# EAGLE design key (EAGLE 7.2.0)
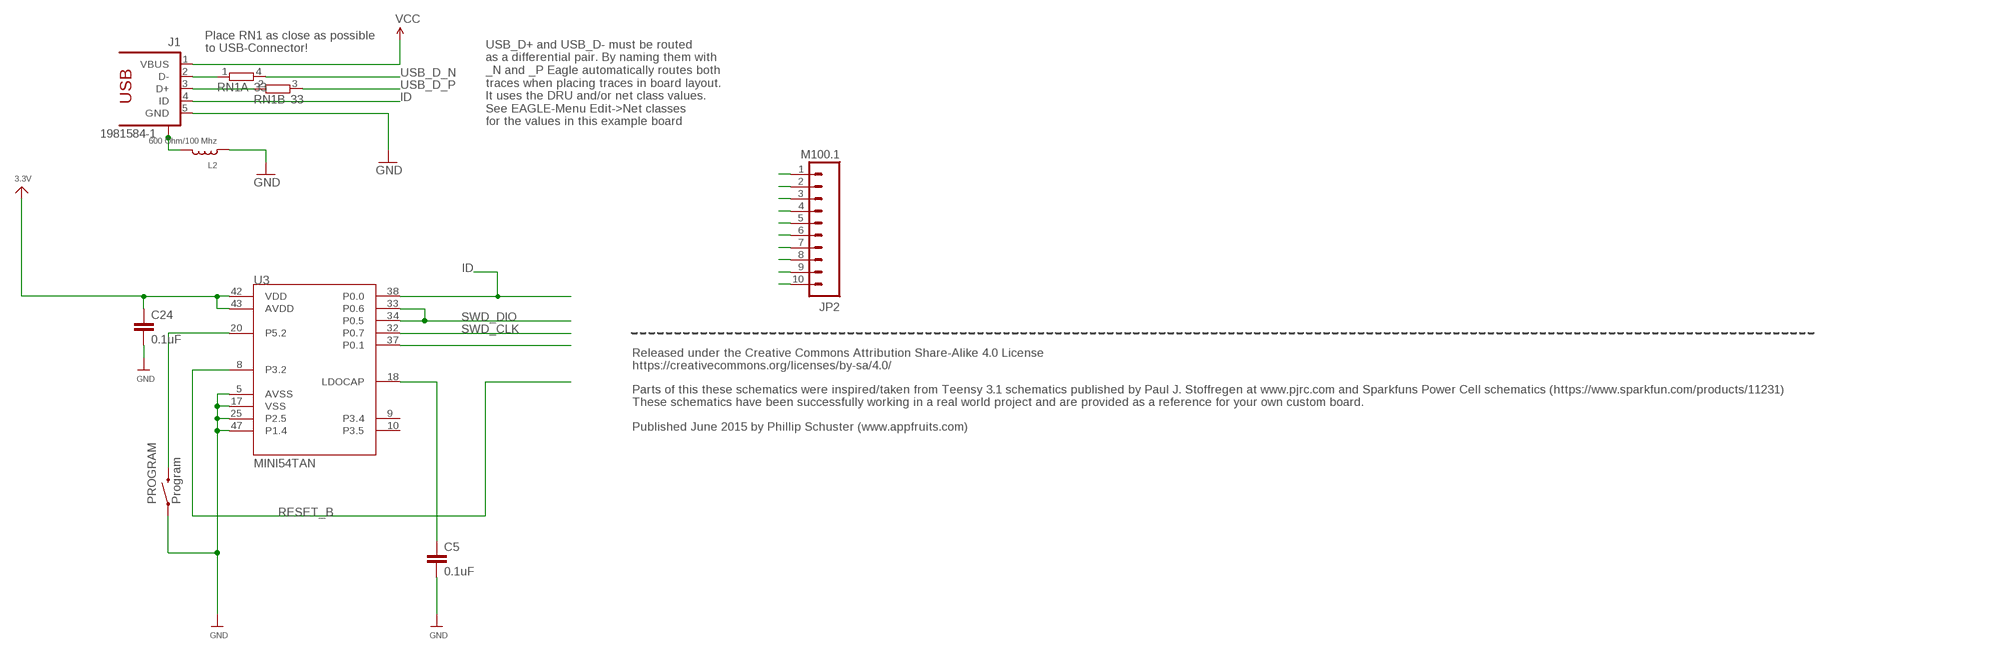
[diagram p0: schematic, sheet 1]

## Parts
C5  0.1uF  CAPACITOR-0.1UF  [0603-CAP]
C24  0.1uF  CAPACITOR-0.1UF  [0603-CAP]
J1  1981584-1  [1981584-1]
JP2  M100.1  [1X10]
L2  600 Ohm/100 Mhz  INDUCTOR-BK2125HM601-T  [0805]
PROGRAM  Program  SWITCH-MOMENTARY-2-SMD-1101NE  [TACTILE-SWITCH-1101NE]
RN1  33  2R-NEXB34V  [EXB34V]
U3  MINI54TAN  [MINI54TAN]

## Nets
3.3V: C24.1 JP2.10 U3.42(VDD) U3.43(AVDD)
GND [Top GND Pour]: C5.2 C24.2 J1.5(GND) JP2.1 L2.1 PROGRAM.P$1 U3.5(AVSS) U3.17(VSS) U3.25(P2.5) U3.47(P1.4)
ID: J1.4(ID) JP2.5 U3.38(P0.0)
N$17: PROGRAM.P$2 U3.20(P5.2)
N$18: C5.1 U3.18(LDOCAP)
P0.1: JP2.8 U3.37(P0.1)
RESET_B: JP2.9 U3.8(P3.2)
SWD_CLK: JP2.7 U3.32(P0.7)
SWD_DIO: JP2.6 U3.33(P0.6) U3.34(P0.5)
USB_CON_N [USB]: J1.2(D-) RN1.1
USB_CON_P [USB]: J1.3(D+) RN1.2
USB_D_N [USB]: JP2.3 RN1.4
USB_D_P [USB]: JP2.4 RN1.3
USB_SHIELD: J1.S1 J1.S2 J1.S3 J1.S4 L2.2
VCC: J1.1(VBUS) JP2.2
Unconnected: U3.9(P3.4) U3.10(P3.5)

## Notes on the sheet
- Place RN1 as close as possible
  to USB-Connector!
- USB_D+ and USB_D- must be routed
  as a differential pair. By naming them with
  _N and _P Eagle automatically routes both
  traces when placing traces in board layout.
  It uses the DRU and/or net class values. 
  See EAGLE-Menu Edit->Net classes 
  for the values in this example board
- Released under the Creative Commons Attribution Share-Alike 4.0 License
  https://creativecommons.org/licenses/by-sa/4.0/
- Parts of this these schematics were inspired/taken from Teensy 3.1 schematics published by Paul J. Stoffregen at www.pjrc.com and Sparkfuns Power Cell schematics (https://www.sparkfun.com/products/11231)
  These schematics have been successfully working in a real world project and are provided as a reference for your own custom board.
- Published June 2015 by Phillip Schuster (www.appfruits.com)

## Library data of the parts
C5 C24 = appfruits:CAPACITOR; MF: Kemet; MPN: C0603C104J3RACTU
J1 = con-usb:1981584-1: Receptacle, micro-USB, type A/B Tyco Electronics; MF: Hirose; MPN: ZX62-AB-5PA(11)
JP2 = umich:M10: Header 10 Standard 10-pin 0.1" header. Use with straight break away headers (SKU : PRT-00116), right angle break away headers (PRT-00553), swiss pins (PRT-00743), machine pins (PRT-00117), and female headers (PRT-00115).
L2 = appfruits:INDUCTOR: Inductors 0603: 10nH Ceramic Inductor - microwire antenna/RF (Digikey: 712-1434-2-ND) 0805: 560nH Ceramic Inductor - RF (Digikey: 553-1047-1-ND) 270nH Ceramic Inductor - Q = 40@250MHz, +-5%, 1 Ohm DC Resistance (Digikey: 535-10506-2-ND) 1007 (2518 Metric) SMT: 10µH 10% 250mOhm 820mA 1007 Inductor (Digikey: 587-2189-1-ND) 22µH 10% 500mOhm 580mA 1007 Inductor (Digikey: 587-2190-1-ND) 47µH 10% 950mOhm 420mA 1007 Inductor (Digikey: 587-2191-1-ND) 47µH 5% 100mOhm 1A 1008 Inductor (Digikey: 732-1816-1-ND) 5.0x5.0mm (Taiyo Yuden NR5040 Series) 6.8µH 20% 2.3A 64mOhm Inductor (Digikey: 587-2374-2-ND) 5.0x5.0mm (TDK VLC5045 Series) 4.7µH 20% 3.3A 34mOhm Inductor (Digikey: 445-6526-1-ND) 6.8µH 20% 2.7A 46mOhm Inductor (Digikey: 445-6527-1-ND) 6.0x6.0mm (TDK VLC6045 Series) 4.7µH 20% 3.8A 27mOhm Inductor (Digikey: 445-6538-2-ND) 6.8µH 20% 3A 41mOhm Inductor (Digikey: 445-6540-1-ND) 6.2µH 30% 2.2A 45mOhm Inductor (Digikey: SRR5028-6R2YCT-ND) - Not TDK VLC6045 but footprint should match 6.0x6.0mm (TDK SLF6045 Series) 6.8uH 30% 2A 33mOhm Inductor (Digikey: 445-4572-1-ND, Mouser: 810-SLF645T6R8N2R0PF) 6.0x6.0mm (Sumida CDRH5D28 Series) 6.2uH 30% 1.8A 45mOhm Inductor (Digikey: 308-1542-1-ND) Taiyo Yuden NR3015T2R2M - 2.2uH 20% 1.5A (Digikey: 587-1648-2-ND, Mouser: 963-NR3015T2R2M) - Used with TI TPS62172 CoilCraft RFID Transponder Coil - MA5532-AE (For use with AS3935 Lightning Sensor); MF: Taiyo Yuden; MPN: BK2125HM601-T
PROGRAM = SparkFun-Electromechanical:SWITCH-MOMENTARY-2: Various NO switches- pushbuttons, reed, etc; MF: C&K Components; MPN: RS-282G05A3-SM RT
RN1 = resistor-dil:2R-N: Array Chip Resistor Source: Panasonic; MF: Panasonic; MPN: EXB-34V330JV; OC_FARNELL: unknown; OC_NEWARK: unknown
U3 = TeensyCustom:MINI54TAN: MINI54TAN Bootloader from PJRC.com, preprogrammed with Teensy 3.0 bootloader. https://www.pjrc.com/store/ic_mini54_tqfp.html

## Net classes
1 USB: width 0.254 mm, drill 0.33 mm, clearance 0.159 mm

## Board
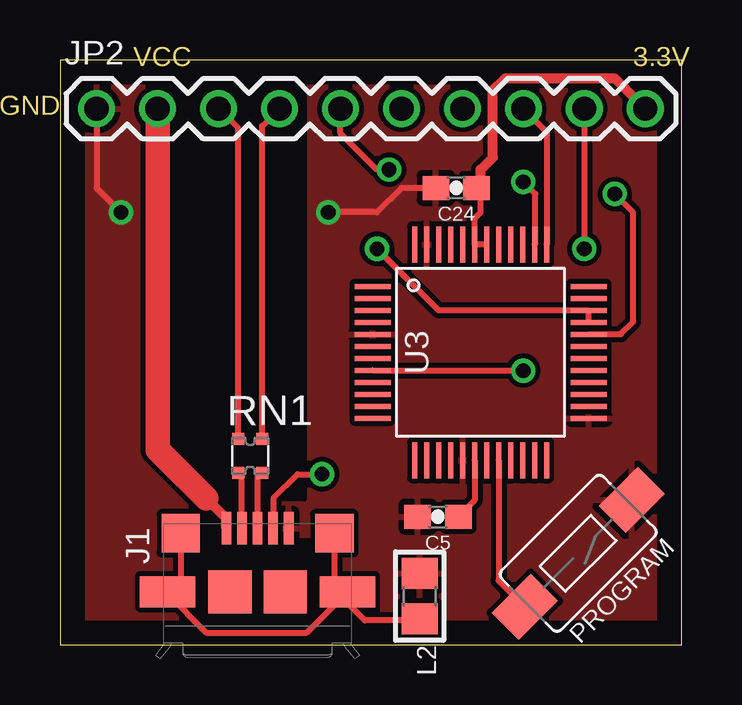
[diagram p1: board, top side]
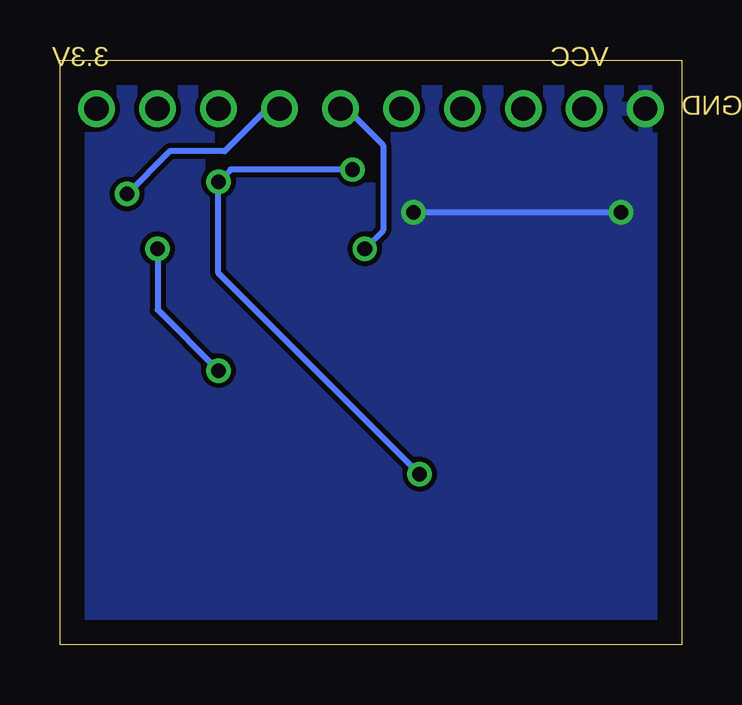
[diagram p2: board, bottom side, seen from below]

Size 25.91 x 24.38 mm. Coordinates in mm from the lower left corner, seen from the top.
Outline: 0,0 25.91,0 25.91,24.38 0,24.38 0,0
Copper layers (1*16): Top 0.035mm / dielectric 1.5mm / Bottom 0.035mm
Design rules "default": minimum track width 10mil, minimum drill 24mil, track to track 8mil, track to pad 8mil, pad to pad 8mil, via to via 8mil, smd to smd 8mil, copper to edge 40mil, drill to drill 8mil, minimum pad ring 10mil, minimum via ring 8mil, stop-mask expansion 4mil, vias tented up to drill 0mil, thermal gap 10mil
tRestrict: area 8.4,3.3 to 11.2,4.3; area 5.6,6.1 to 10.2,23.6

### Footprints (pad centres in the part's own frame; a part is rotated, then mirrored left to right if it is on the bottom)
0603-CAP = smd 1.1 x 1: 1 -0.85,0; 2 0.85,0
1981584-1 = smd 0.4 x 1.35: 1 -1.3,4.1; 2 -0.65,4.1; 3 0,4.1; 4 0.65,4.1; 5 1.3,4.1 | smd 1.8 x 1.8: M1 -1.15,1.45; M2 1.15,1.45 | smd 2.3 x 1.3: S1 -3.75,1.45; S2 3.75,1.45 | smd 1.6 x 1.6: S3 -3.2,3.885; S4 3.2,3.885
1X10 = drill 1.016: 1 -11.43,0; 2 -8.89,0; 3 -6.35,0; 4 -3.81,0; 5 -1.27,0; 6 1.27,0; 7 3.81,0; 8 6.35,0; 9 8.89,0; 10 11.43,0
0805 = smd 1.3 x 1.5: 1 -0.95,0; 2 0.95,0
TACTILE-SWITCH-1101NE = smd 2.3 x 1.6: P$1 -3.15,0; P$2 3.15,0
EXB34V = smd 0.5 x 0.5: 1 -0.5,-0.7; 2 0.5,-0.7; 3 0.5,0.7; 4 -0.5,0.7
MINI54TAN = smd 0.203 x 1.5: 1 -2.75,-4.5; 2 -2.25,-4.5; 3 -1.75,-4.5; 4 -1.25,-4.5; 5 -0.75,-4.5; 6 -0.25,-4.5; 7 0.25,-4.5; 8 0.75,-4.5; 9 1.25,-4.5; 10 1.75,-4.5; 11 2.25,-4.5; 12 2.75,-4.5; 25 2.75,4.5; 26 2.25,4.5; 27 1.75,4.5; 28 1.25,4.5; 29 0.75,4.5; 30 0.25,4.5; 31 -0.25,4.5; 32 -0.75,4.5; 33 -1.25,4.5; 34 -1.75,4.5; 35 -2.25,4.5; 36 -2.75,4.5 | smd 1.5 x 0.203: 13 4.5,-2.75; 14 4.5,-2.25; 15 4.5,-1.75; 16 4.5,-1.25; 17 4.5,-0.75; 18 4.5,-0.25; 19 4.5,0.25; 20 4.5,0.75; 21 4.5,1.25; 22 4.5,1.75; 23 4.5,2.25; 24 4.5,2.75; 37 -4.5,2.75; 38 -4.5,2.25; 39 -4.5,1.75; 40 -4.5,1.25; 41 -4.5,0.75; 42 -4.5,0.25; 43 -4.5,-0.25; 44 -4.5,-0.75; 45 -4.5,-1.25; 46 -4.5,-1.75; 47 -4.5,-2.25; 48 -4.5,-2.75

### Placement (x,y rotation side)
C5  15.75,5.33 180 top
C24  16.51,19.05 180 top
J1  8.23,0.76 0 top
JP2  12.95,22.35 0 top
L2  14.99,2.03 270 top
PROGRAM  21.59,3.81 225 top
RN1  7.92,7.87 0 top
U3  17.53,12.19 270 top

### Tracks (layer width: path | path; a pad name or v marks a point on that pad's centre or on a via)
3.3V
  Top 0.254: U3.42 U3.43 17.28,17.78 17.53,18.03 17.53,18.88 C24.1
  Top 0.406: 17.53,18.88 17.53,19.81 18.03,20.32 18.03,23.11 18.54,23.62 23.11,23.62 JP2.10
GND  (via drill 0.61)
  Top 0.254: C24.2 14.22,19.05 13.21,18.03 v11.18,18.03 | JP2.1 1.52,19.05 v2.54,18.03
  Bottom 0.254: v11.18,18.03 v2.54,18.03
  pour Top: -7.87,27.94 27.94,27.94 27.94,-6.35 -7.87,-6.35
  pour Bottom: -2.29,26.67 29.97,26.67 29.97,-4.32 -2.29,-4.32
ID  (via drill 0.61)
  Top 0.254: U3.38 19.81,16.73 19.81,18.8 v19.3,19.3 | v10.92,7.11 9.91,7.11 8.89,6.1 8.89,4.87 J1.4 | v13.72,19.81 13.21,19.81 11.68,21.34 JP2.5
  Bottom 0.254: v13.72,19.81 18.8,19.81 v19.3,19.3 19.3,15.49 v10.92,7.11
N$17
  Top 0.254: U3.20 18.28,2.67 PROGRAM.P$2
N$18
  Top 0.254: U3.18 17.28,6.01 C5.1
P0.1
  Top 0.254: U3.37 20.28,21.38 JP2.8
RESET_B  (via drill 0.61)
  Top 0.254: U3.8 19.29,11.44 v19.3,11.43 | JP2.9 v21.84,16.51
  Bottom 0.254: v21.84,16.51 21.84,13.97 v19.3,11.43
SWD_CLK  (via drill 0.61)
  Top 0.254: U3.32 22.04,12.95 23.37,12.95 23.88,13.46 23.88,18.03 v23.11,18.8
  Bottom 0.254: v23.11,18.8 21.34,20.57 19.05,20.57 17.27,22.35 JP2.7
SWD_DIO  (via drill 0.61)
  Top 0.254: U3.33 U3.34 15.78,13.94 v13.21,16.51
  Bottom 0.254: v13.21,16.51 12.45,17.27 12.45,20.83 13.97,22.35 JP2.6
USB_CON_N
  Top 0.254: J1.2 7.58,7.02 RN1.1
USB_CON_P
  Top 0.254: J1.3 8.23,6.98 RN1.2
USB_D_N
  Top 0.254: RN1.4 7.42,21.53 JP2.3
USB_D_P
  Top 0.254: RN1.3 8.43,21.63 JP2.4
USB_SHIELD
  Top 0.254: J1.S1 4.93,1.75 | L2.2 14.92,1.02 12.7,1.02 11.88,1.84 J1.S2 | J1.S4 11.43,2.76 J1.S2 | J1.S1 4.48,2.12 6.1,0.51 10.28,0.51 J1.S2 | J1.S3 5.03,2.76 J1.S1
VCC
  Top 0.406: 6.1,6.1 6.93,5.26 J1.1
  Top 1.016: JP2.2 4.06,8.13 6.1,6.1

### Text on the board
Dimension: VCC | 3.3V | GND